# EAGLE design MotorController V3 (EAGLE 9.2.0)
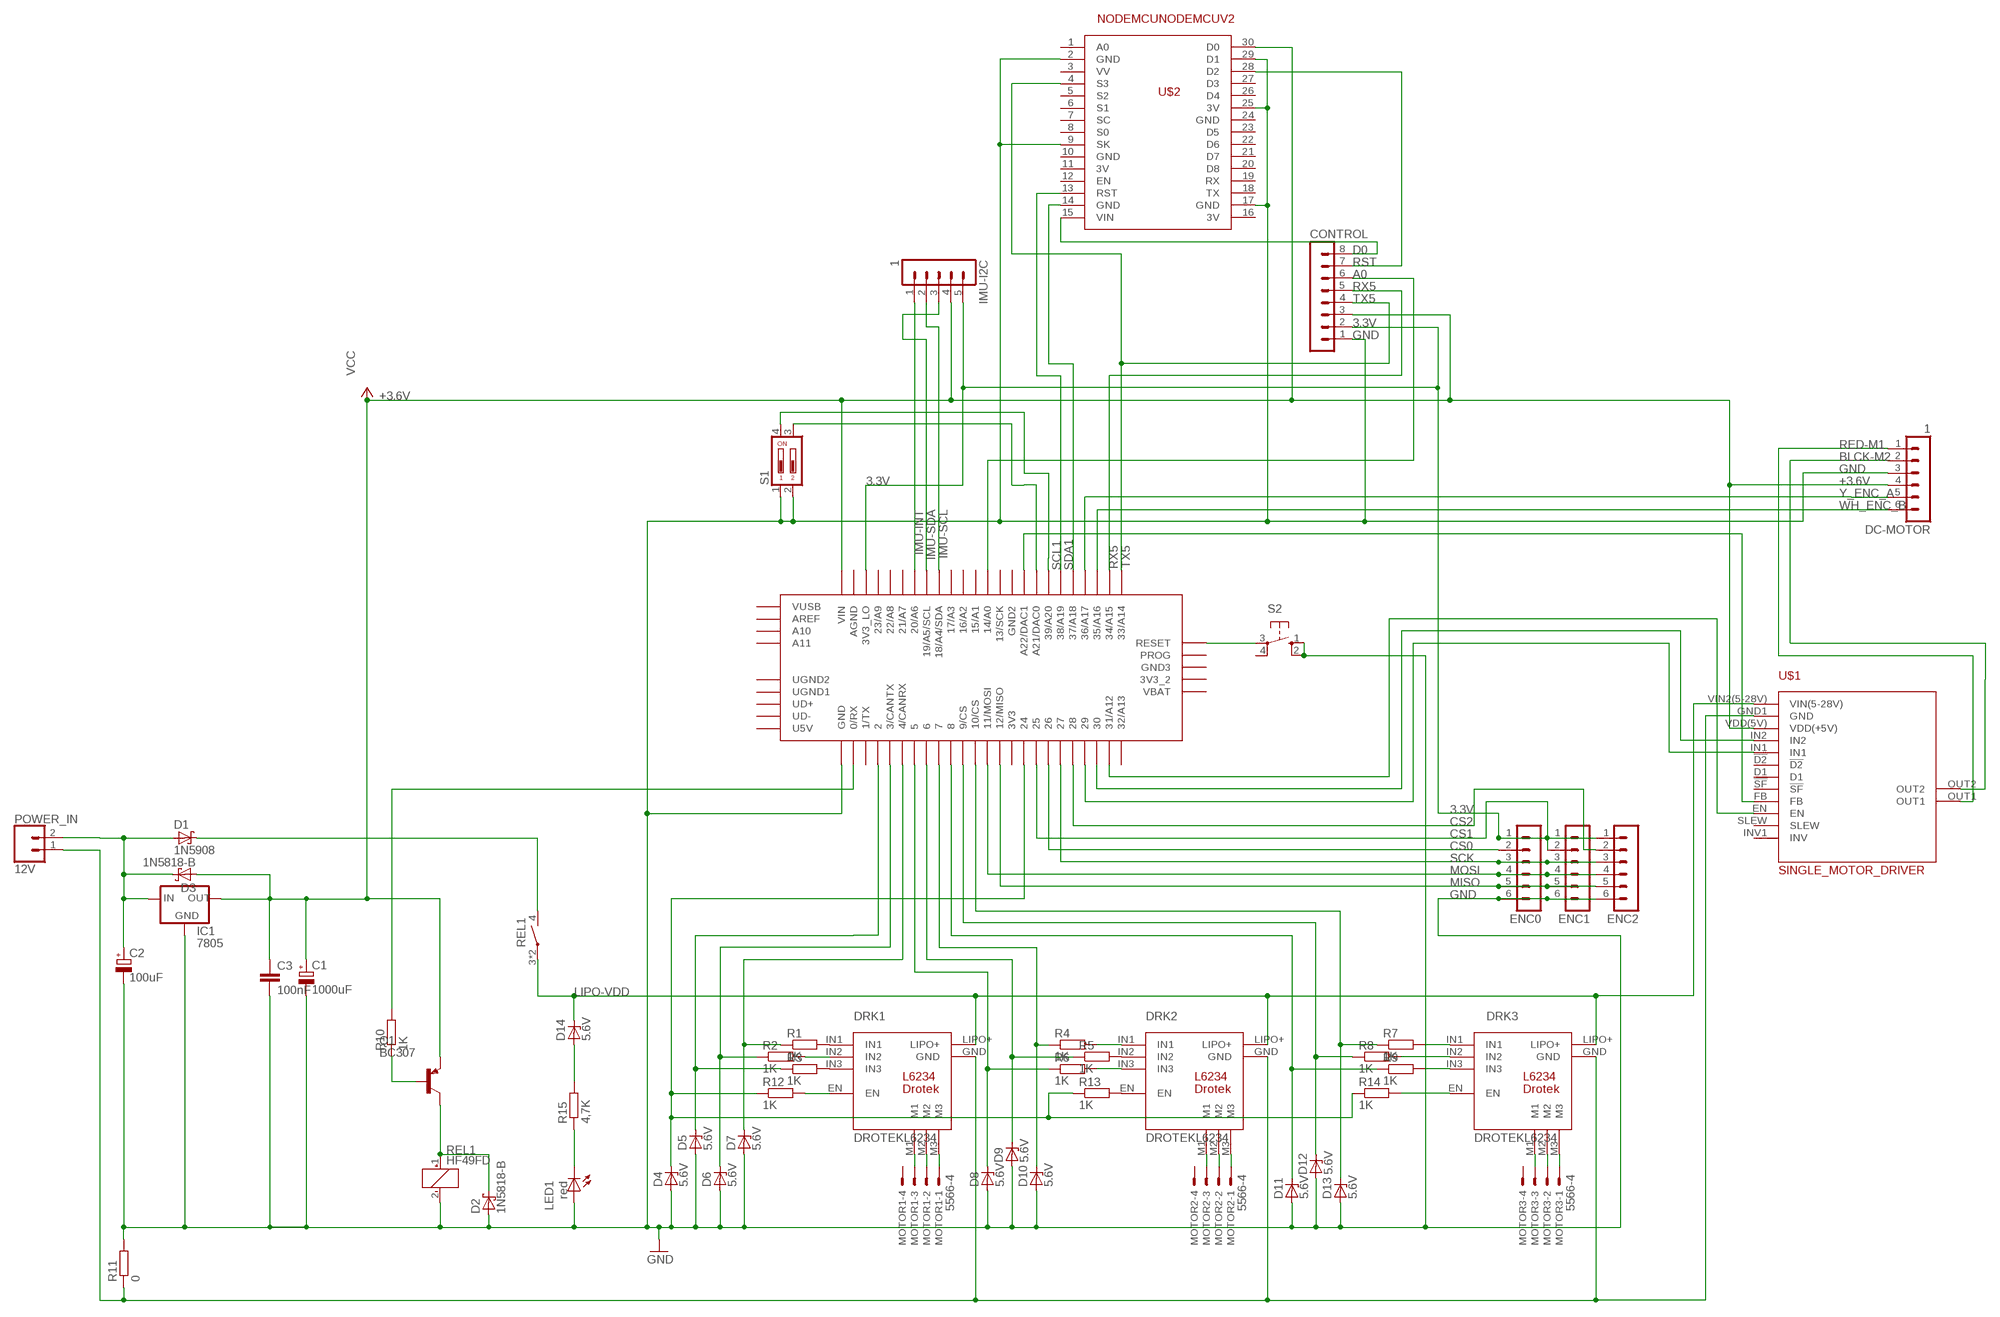
[diagram p0: schematic, sheet 1]

## Parts
C1  1000uF  CPOL-EUE2.5-6  [E2,5-6]
C2  100uF  CPOL-EUE5-5  [E5-5]
C3  100nF  C2.5/2  [C2.5-2]
CONTROL  MA08-1  [MA08-1]
D1  1N5908  [C4111-15]
D2  1N5818-B  [DO41-7.6]
D3  1N5818-B  [DO41-7.6]
D4  5.6V  ZENER-DIODEDO41Z10  [DO41Z10]
D5  5.6V  ZENER-DIODEDO41Z10  [DO41Z10]
D6  5.6V  ZENER-DIODEDO41Z10  [DO41Z10]
D7  5.6V  ZENER-DIODEDO41Z10  [DO41Z10]
D8  5.6V  ZENER-DIODEDO41Z10  [DO41Z10]
D9  5.6V  ZENER-DIODEDO41Z10  [DO41Z10]
D10  5.6V  ZENER-DIODEDO41Z10  [DO41Z10]
D11  5.6V  ZENER-DIODEDO41Z10  [DO41Z10]
D12  5.6V  ZENER-DIODEDO41Z10  [DO41Z10]
D13  5.6V  ZENER-DIODEDO41Z10  [DO41Z10]
D14  5.6V  ZENER-DIODEDO41Z10  [DO41Z10]
DC-MOTOR  1  MA06-1  [MA06-1]
DRK1  DROTEKL6234  [DROTEKL6234]
DRK2  DROTEKL6234  [DROTEKL6234]
DRK3  DROTEKL6234  [DROTEKL6234]
ENC0  MA06-1  [MA06-1]
ENC1  MA06-1  [MA06-1]
ENC2  MA06-1  [MA06-1]
IC1  7805  78XXS  [78XXS]
IMU-I2C  1  MA05-1  [MA05-1]
LED1  red  LED3MM  [LED3MM]
MOTOR1  5566-4  [5566-4]
MOTOR2  5566-4  [5566-4]
MOTOR3  5566-4  [5566-4]
POWER_IN  12V  CONN_023.5MM  [SCREWTERMINAL-3.5MM-2]
PRJ1  TEENSY_3.5/3.6  [TEENSY_3.5/3.6]
Q1  BC307  [TO92]
R1  1K  R-EU_0207/10  [0207/10]
R2  1K  R-EU_0207/10  [0207/10]
R3  1K  R-EU_0207/10  [0207/10]
R4  1K  R-EU_0207/10  [0207/10]
R5  1K  R-EU_0207/10  [0207/10]
R6  1K  R-EU_0207/10  [0207/10]
R7  1K  R-EU_0207/10  [0207/10]
R8  1K  R-EU_0207/10  [0207/10]
R9  1K  R-EU_0207/10  [0207/10]
R10  1K  R-EU_0207/10  [0207/10]
R11  0  R-EU_0204/2V  [0204V]
R12  1K  R-EU_0207/10  [0207/10]
R13  1K  R-EU_0207/10  [0207/10]
R14  1K  R-EU_0207/10  [0207/10]
R15  4,7K  R-EU_0207/10  [0207/10]
REL1  HF49FD  [HF49FD]
S1  DIP02YL  [DIP02YL]
S2  10-XX  [B3F-10XX]
U$1  SINGLE_MOTOR_DRIVER  [MOTOR_DRIVER_MC33926_FOOTPRINT_]
U$2  NODEMCUNODEMCUV2  [NODEMCUV2]

## Nets
3.3V: CONTROL.2 ENC0.1 ENC1.1 ENC2.1 IMU-I2C.5 PRJ1.3V3_LO
+3.6V: C1.+ C3.1 CONTROL.3 D3.A DC-MOTOR.4 IC1.OUT IMU-I2C.4 PRJ1.VIN Q1.1(E) U$1.VDD(5V)(VDD(+5V)) U$2.30(D0) ; supply symbol labelled VCC
A0: CONTROL.6 PRJ1.14/A0
BLCK-M2 [Powerline]: DC-MOTOR.2 U$1.OUT2
CS0: ENC0.2 PRJ1.26
CS1: ENC1.2 PRJ1.25
CS2: ENC2.2 PRJ1.28
D0: CONTROL.8 U$2.15(VIN)
GND: C1.- C2.- C3.2 CONTROL.1 D2.A D4.A D5.A D6.A D7.A D8.A D9.A D10.A D11.A D12.A D13.A DC-MOTOR.3 ENC0.6 ENC1.6 ENC2.6 IC1.GND LED1.A PRJ1.GND R11.2 REL1.2(-) S1.1 S1.2 S2.1(S) S2.2(S1) U$2.2(GND) U$2.9(SK) U$2.17(GND) U$2.25(3V) U$2.29(D1)
IMU-INT: IMU-I2C.1 PRJ1.20/A6
IMU-SCL: IMU-I2C.2 PRJ1.18/A4/SDA
IMU-SDA: IMU-I2C.3 PRJ1.19/A5/SCL
LIPO-GND [Powerline]: DRK1.GND DRK2.GND DRK3.GND POWER_IN.1 R11.1 U$1.GND1(GND)
LIPO-VDD [Powerline]: D14.C DRK1.LIPO+ DRK2.LIPO+ DRK3.LIPO+ REL1.3(P) REL1.5(P) U$1.VIN2(5-28V)(VIN(5-28V))
MISO: ENC0.5 ENC1.5 ENC2.5 PRJ1.12/MISO
MOSI: ENC0.4 ENC1.4 ENC2.4 PRJ1.11/MOSI
N$1 [Powerline]: DRK1.M1 MOTOR1.3
N$2 [Powerline]: DRK1.M2 MOTOR1.2
N$3 [Powerline]: DRK1.M3 MOTOR1.1
N$4: DRK1.IN1 R1.2
N$5: DRK1.IN2 R2.2
N$6: DRK1.IN3 R3.2
N$7: D7.C PRJ1.4/CANRX R1.1
N$8: D6.C PRJ1.3/CANTX R2.1
N$9: D5.C PRJ1.2 R3.1
N$10: DRK3.EN R14.2
N$11: DRK2.IN1 R4.2
N$12: PRJ1.21/DAC0(A21/DAC0) S1.3
N$13 [Powerline]: DRK2.M1 MOTOR2.3
N$14 [Powerline]: DRK2.M2 MOTOR2.2
N$15 [Powerline]: DRK2.M3 MOTOR2.1
N$16 [Powerline]: DRK3.M1 MOTOR3.3
N$17 [Powerline]: DRK3.M2 MOTOR3.2
N$18 [Powerline]: DRK3.M3 MOTOR3.1
N$19: DRK2.IN2 R5.2
N$20: DRK2.IN3 R6.2
N$21: D8.C PRJ1.5 R6.1
N$22: D9.C PRJ1.6 R5.1
N$23: D10.C PRJ1.7 R4.1
N$24: DRK3.IN2 R8.2
N$25: DRK3.IN1 R7.2
N$26: DRK3.IN3 R9.2
N$27: D11.C PRJ1.8 R9.1
N$28: D12.C PRJ1.9/CS R8.1
N$29: D13.C PRJ1.10/CS R7.1
N$30: Q1.2(B) R10.1
N$31: D2.C Q1.3(C) REL1.1(+)
N$32 [Powerline]: C2.+ D1.A D3.C IC1.IN POWER_IN.2
N$33: D14.A R15.2
N$34: LED1.K(C) R15.1
N$39 [Powerline]: D1.C REL1.4(S)
N$40: PRJ1.39/A20 S1.4
N$42: PRJ1.0/RX R10.2
N$43: DRK1.EN R12.2
N$44: PRJ1.29 U$1.IN1
N$45: PRJ1.31/A12 U$1.EN
N$46: D4.C PRJ1.24 R12.1 R13.1 R14.1
N$47: PRJ1.30 U$1.IN2
N$48: DRK2.EN R13.2
N$52: PRJ1.RESET S2.3(P)
N$60: PRJ1.A22/DAC1 U$1.FB
RED-M1 [Powerline]: DC-MOTOR.1 U$1.OUT1
RST: CONTROL.7 U$2.28(D2)
RX5: CONTROL.5 PRJ1.34/A15
SCK: ENC0.3 ENC1.3 ENC2.3 PRJ1.27
SCL1: PRJ1.38/A19 U$2.13(RST)
SDA1: PRJ1.37/A18 U$2.14(GND)
TX5: CONTROL.4 PRJ1.33/A14 U$2.4(S3)
WH_ENC_B: DC-MOTOR.6 PRJ1.35/A16
Y_ENC_A: DC-MOTOR.5 PRJ1.36/A17
Unconnected: MOTOR1.4 MOTOR2.4 MOTOR3.4 PRJ1.1/TX PRJ1.3V3 PRJ1.3V3_2 PRJ1.13/SCK PRJ1.15/A1 PRJ1.16/A2 PRJ1.17/A3 PRJ1.21/A7 PRJ1.22/A8 PRJ1.23/A9 PRJ1.32/A13 PRJ1.A10 PRJ1.A11 PRJ1.AGND PRJ1.AREF PRJ1.GND2 PRJ1.GND3 PRJ1.PROG PRJ1.U5V PRJ1.UD+ PRJ1.UD- PRJ1.UGND1 PRJ1.UGND2 PRJ1.VBAT PRJ1.VUSB S2.4(P1) U$1.!D2 U$1.!SF U$1.D1 U$1.INV1(INV) U$1.SLEW U$2.1(A0) U$2.3(VV) U$2.5(S2) U$2.6(S1) U$2.7(SC) U$2.8(S0) U$2.12(EN) U$2.18(TX) U$2.19(RX) U$2.20(D8) U$2.21(D7) U$2.22(D6) U$2.23(D5) U$2.26(D4) U$2.27(D3)

## Power pins joined to a net without a drawn wire
3V: U$2.11(3V) U$2.16(3V)
GND: U$2.10(GND) U$2.24(GND)

## Library data of the parts
C1 C2 = rcl:CPOL-EU: POLARIZED CAPACITOR, European symbol; SPICEPREFIX: C
C3 = capacitor-wima:C: CAPACITOR naming: grid - package width
CONTROL = con-lstb:MA08-1: PIN HEADER; OC_FARNELL: unknown; OC_NEWARK: unknown
D1 = diode:1N5908: DIODE schottky
D2 D3 = diode:1N581*: 1.0A SCHOTTKY BARRIER RECTIFIER Source: http://www.diodes.com/datasheets/ds23001.pdf
D4-D14 = diode:ZENER-DIODE: Z-Diode
DC-MOTOR ENC0 ENC1 ENC2 = con-lstb:MA06-1: PIN HEADER; OC_FARNELL: unknown; OC_NEWARK: unknown
DRK1-DRK3 = Drotek L6234:DROTEKL6234
IC1 = v-reg:78XXS: VOLTAGE REGULATOR
IMU-I2C = con-lstb:MA05-1: PIN HEADER; OC_FARNELL: unknown; OC_NEWARK: unknown
LED1 = led:LED: LED OSRAM: - CHIPLED LG R971, LG N971, LY N971, LG Q971, LY Q971, LO R971, LY R971 LH N974, LH R974 LS Q976, LO Q976, LY Q976 LO Q996 - Hyper CHIPLED LW Q18S LB Q993, LB Q99A, LB R99A - SideLED LS A670, LO A670, LY A670, LG A670, LP A670 LB A673, LV A673, LT A673, LW A673 LH A674 LY A675 LS A676, LA A676, LO A676, LY A676, LW A676 LS A679, LY A679, LG A679 - Hyper Micro SIDELED® LS Y876, LA Y876, LO Y876, LY Y876 LT Y87S - SmartLED LW L88C, LW L88S LB L89C, LB L89S, LG L890 LS L89K, LO L89K, LY L89K LS L896, LA L896, LO L896, LY L896 - TOPLED LS T670, LO T670, LY T670, LG T670, LP T670 LSG T670, LSP T670, LSY T670, LOP T670, LYG T670 LG T671, LOG T671, LSG T671 LB T673, LV T673, LT T673, LW T673 LH T674 LS T676, LA T676, LO T676, LY T676, LB T676, LH T676, LSB T676, LW T676 LB T67C, LV T67C, LT T67C, LS T67K, LO T67K, LY T67K, LW E67C LS E67B, LA E67B, LO E67B, LY E67B, LB E67C, LV E67C, LT E67C LW T67C LS T679, LY T679, LG T679 LS T770, LO T770, LY T770, LG T770, LP T770 LB T773, LV T773, LT T773, LW T773 LH T774 LS E675, LA E675, LY E675, LS T675 LS T776, LA T776, LO T776, LY T776, LB T776 LHGB T686 LT T68C, LB T68C - Hyper Mini TOPLED® LB M676 - Mini TOPLED Santana® LG M470 LS M47K, LO M47K, LY M47K Source: http://www.osram.convergy.de LUXEON: - LUMILED® LXK2-PW12-R00, LXK2-PW12-S00, LXK2-PW14-U00, LXK2-PW14-V00 LXK2-PM12-R00, LXK2-PM12-S00, LXK2-PM14-U00 LXK2-PE12-Q00, LXK2-PE12-R00, LXK2-PE12-S00, LXK2-PE14-T00, LXK2-PE14-U00 LXK2-PB12-K00, LXK2-PB12-L00, LXK2-PB12-M00, LXK2-PB14-N00, LXK2-PB14-P00, LXK2-PB14-Q00 LXK2-PR12-L00, LXK2-PR12-M00, LXK2-PR14-Q00, LXK2-PR14-R00 LXK2-PD12-Q00, LXK2-PD12-R00, LXK2-PD12-S00 LXK2-PH12-R00, LXK2-PH12-S00 LXK2-PL12-P00, LXK2-PL12-Q00, LXK2-PL12-R00 Source: www.luxeon.com KINGBRIGHT: KA-3528ASYC Source: www.kingbright.com
MOTOR1-MOTOR3 = con-molex:5566-4: Mini FIT connector 4 pol Source: http://www.molex.com; MF: MOLEX; OC_FARNELL: unknown; OC_NEWARK: unknown
POWER_IN = SparkFun-Connectors:CONN_02: Multi connection point. Often used as Generic Header-pin footprint for 0.1 inch spaced/style header connections On any of the 0.1 inch spaced packages, you can populate with these: Break Away Headers - Straight <https://www.sparkfun.com/products/116> (PRT-00116) Break Away Male Headers - Right Angle <https://www.sparkfun.com/products/553> (PRT-00553) Female Headers <https://www.sparkfun.com/products/115> (PRT-00115) Break Away Headers - Machine Pin <https://www.sparkfun.com/products/117> (PRT-00117) Break Away Female Headers - Swiss Machine Pin <https://www.sparkfun.com/products/743> (PRT-00743) For SCREWTERMINALS and SPRING TERMINALS visit here: Screw Terimnals on SparkFun.com <https://www.sparkfun.com/search/results?term=Screw+Terminals> (5mm/3.5mm/2.54mm spacing) This device is also useful as a general connection point to wire up your design to another part of your project. Our various solder wires solder well into these plated through hole pads. Hook-Up Wire - Assortment (Stranded, 22 AWG) <https://www.sparkfun.com/products/11375> (PRT-11375) Hook-Up Wire - Assortment (Solid Core, 22 AWG) <https://www.sparkfun.com/products/11367> (PRT-11367) View the entire wire category on our website here <https://www.sparkfun.com/categories/141> Special notes: Molex polarized connector foot print use with: PRT-08233 with associated crimp pins and housings. 2.54_SCREWTERM for use with PRT-10571. 3.5mm Screw Terminal footprints for PRT-08084 5mm Screw Terminal footprints for use with PRT-08432; PROD_ID: CONN-08399
PRJ1 = Teensy356:TEENSY_3.5/3.6
Q1 = transistor-pnp:BC307: PNP Transistor
R1-R10 R12-R15 = rcl:R-EU_: RESISTOR, European symbol; SPICEPREFIX: R
R11 = resistor:R-EU_: RESISTOR, European symbol
REL1 = relay:HF49FD
S1 = switch-dil:DIP02YL: DIL/CODE SWITCH; OC_FARNELL: unknown; OC_NEWARK: unknown
S2 = switch-omron:10-XX: OMRON SWITCH; MPN: B3F-1000; OC_FARNELL: 176432; OC_NEWARK: 36M3542
U$1 = pololu motor driver:SINGLE_MOTOR_DRIVER: Single Motor Driver (MC33926)
U$2 = nodemcu:NODEMCU

## Net classes
0 default: width 0.254 mm, drill 0.635 mm, clearance 0.508 mm
1 Powerline: width 1 mm, drill 0.635 mm, clearance 0.508 mm

## Board
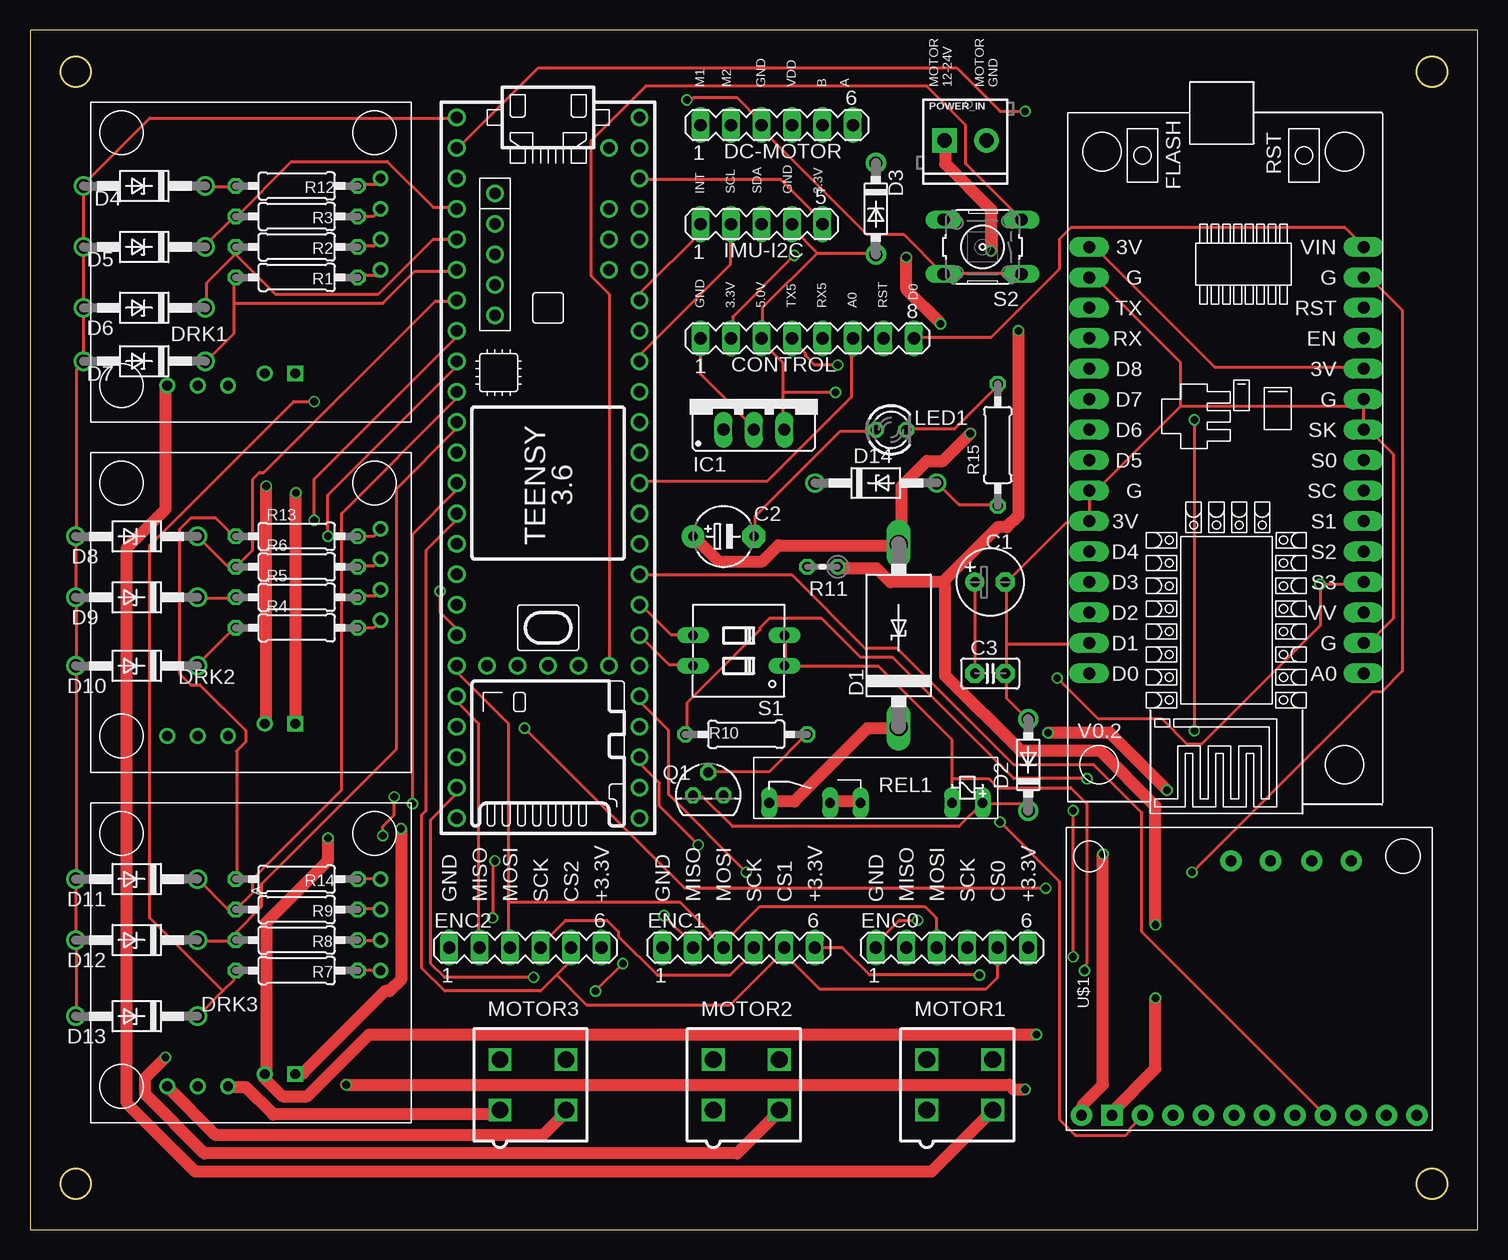
[diagram p1: board, top side]
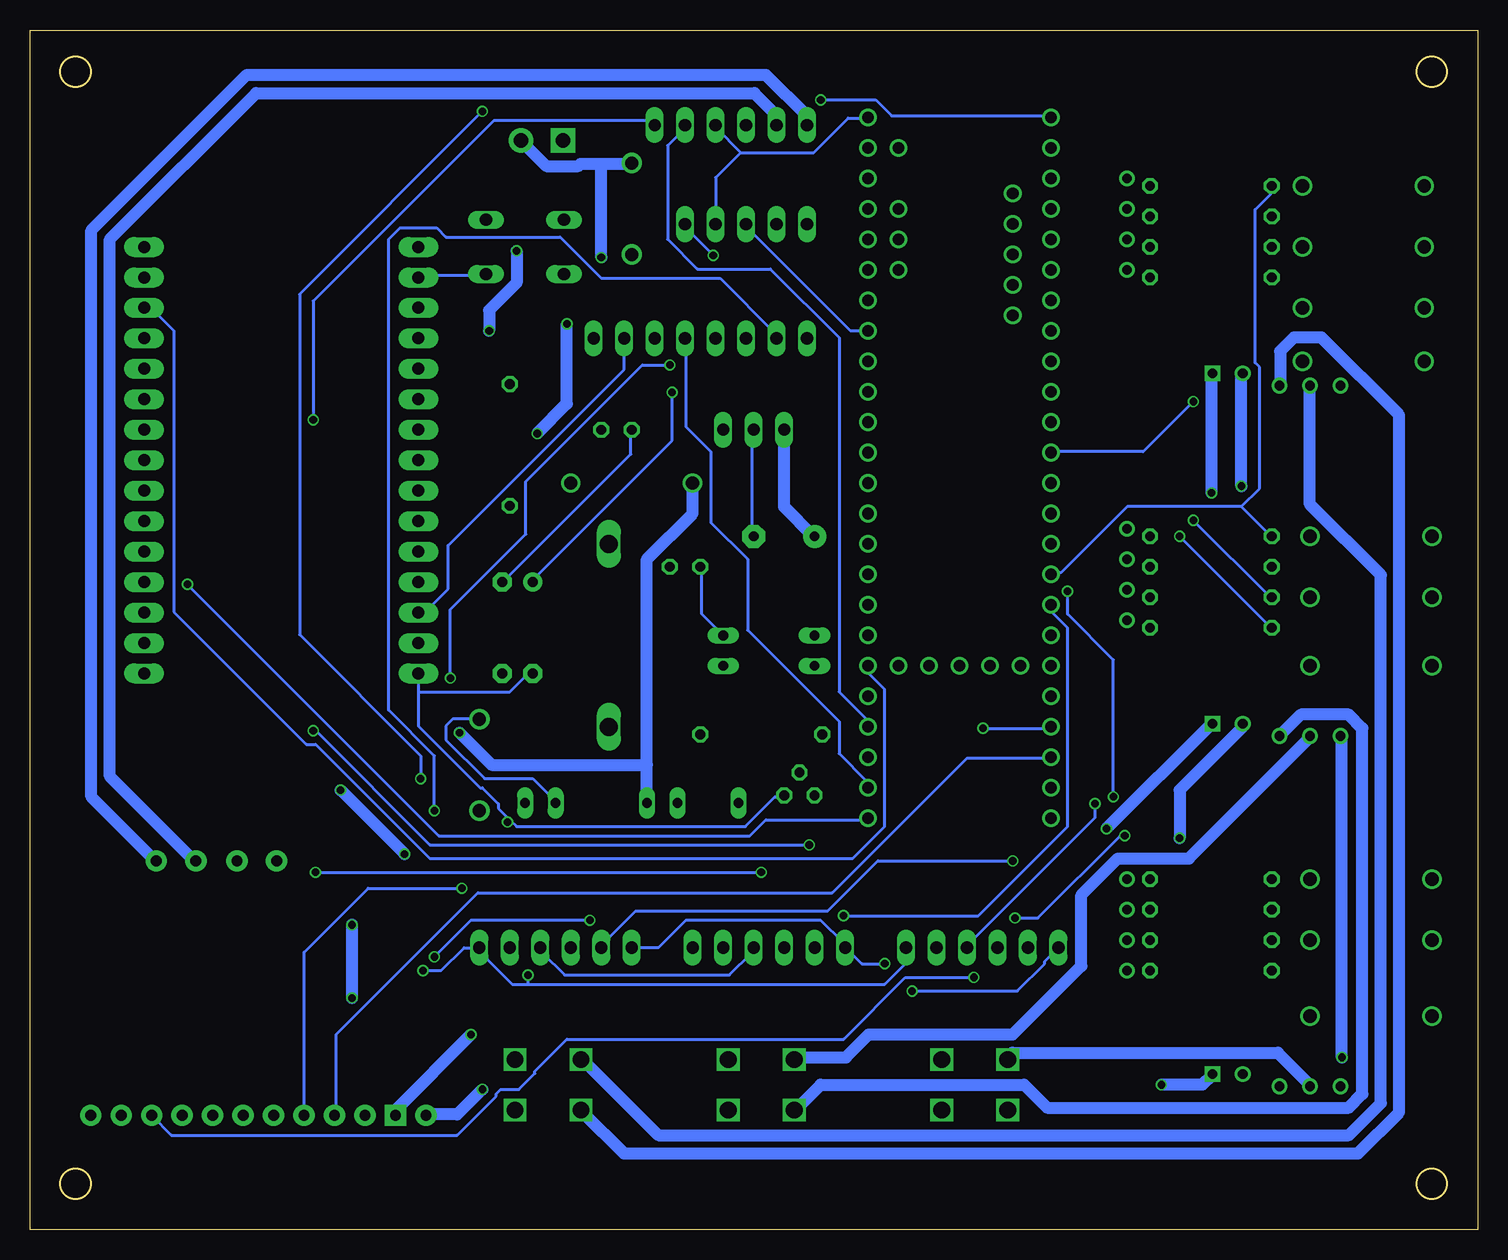
[diagram p2: board, bottom side, seen from below]

Size 120.63 x 100 mm. Coordinates in mm from the lower left corner, seen from the top.
Outline: 0,0 120.63,0 120.63,100 0,100 0,0
Outline: circle at 116.84,96.52 radius 1.27
Outline: circle at 3.81,96.52 radius 1.27
Outline: circle at 3.81,3.81 radius 1.27
Outline: circle at 116.84,3.81 radius 1.27
Copper layers (1*16): Top 0.035mm / dielectric 1.5mm / Bottom 0.035mm
Design rules "aisler_2_layer": minimum track width 0.1mm, minimum drill 0.2mm, track to track 0.1mm, track to pad 0.1mm, pad to pad 0.1mm, via to via 0.1mm, smd to smd 0.1mm, copper to edge 0.2mm, drill to drill 0.21mm, minimum pad ring 0.25mm, minimum via ring 0.15mm, stop-mask expansion 0mil, vias tented up to drill 0mil, thermal gap 10mil

### Footprints (pad centres in the part's own frame; a part is rotated, then mirrored left to right if it is on the bottom)
E2,5-6 = drill 0.813 pad 1.6: + -1.27,0 | drill 0.813 pad 1.6 octagon: - 1.27,0
E5-5 = drill 0.813 pad 1.905: + -2.54,0 | drill 0.813 pad 1.905 octagon: - 2.54,0
C2.5-2 = drill 0.813 pad 1.6 octagon: 1 -1.27,0; 2 1.27,0
MA08-1 = drill 1.016 long: 1 -8.89,0; 2 -6.35,0; 3 -3.81,0; 4 -1.27,0; 5 1.27,0; 6 3.81,0; 7 6.35,0; 8 8.89,0
C4111-15 = drill 1.499 long: A 7.62,0; C -7.62,0
DO41-7.6 = drill 1.1 pad 1.7: A 3.81,0; C -3.81,0
DO41Z10 = drill 1.118: A 5.08,0; C -5.08,0
MA06-1 = drill 1.016 long: 1 -6.35,0; 2 -3.81,0; 3 -1.27,0; 4 1.27,0; 5 3.81,0; 6 6.35,0
DROTEKL6234 = drill 0.813 pad 1.27: EN -11.43,-6.35; GND -1.778,9.906; IN1 -11.43,1.27; IN2 -11.43,-1.27; IN3 -11.43,-3.81; M1 6.35,10.922; M2 3.81,10.922; M3 1.27,10.922 | drill 0.813 square: LIPO+ -4.318,9.906
78XXS = drill 1.016 long: GND 0,-2.54; IN -2.54,-2.54; OUT 2.54,-2.54
MA05-1 = drill 1.016 long: 1 -5.08,0; 2 -2.54,0; 3 0,0; 4 2.54,0; 5 5.08,0
LED3MM = drill 0.813 octagon: A -1.27,0; K 1.27,0
5566-4 = drill 1.4 square: 1 2.1,-2.75; 2 -2.1,-2.75; 3 2.1,2.75; 4 -2.1,2.75
SCREWTERMINAL-3.5MM-2 = drill 1.2 pad 2.032 square: 1 0,0 | drill 1.2 pad 2.032: 2 3.5,0
TEENSY_3.5/3.6 = drill 0.965: 0/RX -25.4,-7.62; 1/TX -22.86,-7.62; 2 -20.32,-7.62; 3/CANTX -17.78,-7.62; 3V3 7.62,-7.62; 3V3_2 17.78,-2.54; 3V3_LO -22.86,7.62; 4/CANRX -15.24,-7.62; 5 -12.7,-7.62; 6 -10.16,-7.62; 7 -7.62,-7.62; 8 -5.08,-7.62; 9/CS -2.54,-7.62; 10/CS 0,-7.62; 11/MOSI 2.54,-7.62; 12/MISO 5.08,-7.62; 13/SCK 5.08,7.62; 14/A0 2.54,7.62; 15/A1 0,7.62; 16/A2 -2.54,7.62; 17/A3 -5.08,7.62; 18/A4/SDA -7.62,7.62; 19/A5/SCL -10.16,7.62; 20/A6 -12.7,7.62; 21/A7 -15.24,7.62; 21/DAC0 12.7,7.62; 22/A8 -17.78,7.62; 23/A9 -20.32,7.62; 24 10.16,-7.62; 25 12.7,-7.62; 26 15.24,-7.62; 27 17.78,-7.62; 28 20.32,-7.62; 29 22.86,-7.62; 30 25.4,-7.62; 31/A12 27.94,-7.62; 32/A13 30.48,-7.62; 33/A14 30.48,7.62; 34/A15 27.94,7.62; 35/A16 25.4,7.62; 36/A17 22.86,7.62; 37/A18 20.32,7.62; 38/A19 17.78,7.62; 39/A20 15.24,7.62; A10 -17.78,5.08; A11 -15.24,5.08; A22/DAC1 10.16,7.62; AGND -25.4,7.62; AREF -20.32,5.08; GND -27.94,-7.62; GND2 7.62,7.62; GND3 17.78,0; PROG 17.78,2.54; RESET 17.78,5.08; U5V -21.59,-4.445; UD+ -16.51,-4.445; UD- -19.05,-4.445; UGND1 -13.97,-4.445; UGND2 -11.43,-4.445; VBAT 17.78,-5.08; VIN -27.94,7.62; VUSB -25.4,5.08
TO92 = drill 0.813 octagon: 1 1.27,0; 2 0,1.905; 3 -1.27,0
0207/10 = drill 0.813 octagon: 1 -5.08,0; 2 5.08,0
0204V = drill 0.813 octagon: 1 -1.27,0; 2 1.27,0
HF49FD = drill 0.813 long: 1 -7.62,0; 2 -5.08,0; 3 2.54,0; 4 10.16,0; 5 5.08,0
DIP02YL = drill 0.813 long: 1 -1.27,-3.81; 2 1.27,-3.81; 3 1.27,3.81; 4 -1.27,3.81
B3F-10XX = drill 1.016 long: 1 -3.251,2.261; 2 3.251,2.261; 3 -3.251,-2.261; 4 3.251,-2.261
MOTOR_DRIVER_MC33926_FOOTPRINT_ = drill 0.9 pad 1.778: !D2 -3.81,0; !SF -3.81,-5.08; D1 -3.81,-2.54; EN -3.81,-10.16; FB -3.81,-7.62; GND 17.399,-3.048; IN1 -3.81,2.54; IN2 -3.81,5.08; INV1 -3.81,-15.24; OUT1 17.399,-9.779; OUT2 17.399,-6.477; SLEW -3.81,-12.7; VDD(5V) -3.81,7.62; VIN2(5-28V) -3.81,12.7; VIN(5-28V) 17.399,0.254 | drill 0.9 pad 1.778 square: GND1 -3.81,10.16
NODEMCUV2 = drill 1 pad 1.676 long: 1 -13.97,17.78; 2 -13.97,15.24; 3 -13.97,12.7; 4 -13.97,10.16; 5 -13.97,7.62; 6 -13.97,5.08; 7 -13.97,2.54; 8 -13.97,0; 9 -13.97,-2.54; 10 -13.97,-5.08; 11 -13.97,-7.62; 12 -13.97,-10.16; 13 -13.97,-12.7; 14 -13.97,-15.24; 15 -13.97,-17.78; 16 8.89,-17.78; 17 8.89,-15.24; 18 8.89,-12.7; 19 8.89,-10.16; 20 8.89,-7.62; 21 8.89,-5.08; 22 8.89,-2.54; 23 8.89,0; 24 8.89,2.54; 25 8.89,5.08; 26 8.89,7.62; 27 8.89,10.16; 28 8.89,12.7; 29 8.89,15.24; 30 8.89,17.78

### Placement (x,y rotation side)
C1  80.01,53.98 0 top
C2  57.79,57.78 0 top
C3  80.01,46.35 0 top
CONTROL  64.77,74.3 0 top
D1  72.39,49.53 90 top
D2  83.19,38.73 90 top
D3  70.49,85.09 270 top
D4  9.53,87 180 top
D5  9.53,81.91 180 top
D6  9.53,76.84 180 top
D7  9.53,72.39 180 top
D8  8.89,57.78 180 top
D9  8.89,52.7 180 top
D10  8.89,46.99 180 top
D11  8.89,29.21 180 top
D12  8.89,24.13 180 top
D13  8.89,17.78 180 top
D14  70.49,62.23 0 top
DC-MOTOR  62.23,92.08 0 top
DRK1  17.78,81.28 180 top
DRK2  17.78,52.07 180 top
DRK3  17.78,22.86 180 top
ENC0  76.84,23.5 0 top
ENC1  59.06,23.5 0 top
ENC2  41.28,23.5 0 top
IC1  60.33,69.22 0 top
IMU-I2C  60.96,83.82 0 top
LED1  71.76,66.67 0 top
MOTOR1  77.47,12.07 270 top
MOTOR2  59.69,12.07 270 top
MOTOR3  41.91,12.07 270 top
POWER_IN  76.2,90.8 0 top
PRJ1  43.18,64.77 270 top
Q1  56.52,36.2 0 top
R1  22.23,79.38 0 top
R2  22.23,81.91 0 top
R3  22.23,84.45 0 top
R4  22.23,50.16 0 top
R5  22.23,52.7 0 top
R6  22.23,55.24 0 top
R7  22.23,21.59 0 top
R8  22.23,24.13 0 top
R9  22.23,26.67 0 top
R10  59.69,41.27 180 top
R11  66.04,55.24 180 top
R12  22.23,87 0 top
R13  22.23,57.78 0 top
R14  22.23,29.21 0 top
R15  80.65,65.41 270 top
REL1  71.76,35.56 180 top
S1  59.06,48.26 90 top
S2  79.38,81.91 180 top
U$1  100.33,13.34 90 top
U$2  97.16,64.14 180 top

### Tracks (layer width: path | path; a pad name or v marks a point on that pad's centre or on a via)
3.3V  (via drill 0.64)
  Top 0.254: PRJ1.3V3_LO 50.93,87.5 62.55,87.5 66.17,83.88 IMU-I2C.5 | v63.69,81.22 58.55,76.07 58.55,74.36 CONTROL.2 | v49.4,22.16 v47.12,19.88 | v86.93,22.73 v86.93,34.92 | v73.98,25.78 72.45,25.78 70.55,23.88 70.55,23.5 ENC0.1
  Bottom 0.254: v63.69,81.22 66.17,83.69 IMU-I2C.5 | ENC2.1 36.07,22.35 36.07,22.16 38.35,19.88 v47.12,19.88 | v49.4,22.16 51.31,22.16 52.64,23.5 ENC1.1 52.83,23.5 52.83,23.88 54.74,25.78 65.98,25.78 68.26,23.5 ENC0.1 | v86.93,34.92 86.93,39.5 90.74,43.31 90.74,82.55 89.79,83.5 86.74,83.5 85.98,82.74 76.45,82.74 73.03,79.31 63.12,79.31 58.55,74.74 58.55,74.36 CONTROL.2 | v86.93,22.73 83.88,25.78 v73.98,25.78
3V
  Top 0.254: U$2.11 111.12,71.88 98.74,71.88 88.84,81.79 88.27,81.79 U$2.16
+3.6V  (via drill 0.64)
  Top 0.254: 62.74,69.79 62.74,72.26 60.83,74.17 CONTROL.3 61.02,74.36 61.02,76.84 65.59,81.41 | 62.74,69.79 62.74,66.74 IC1.OUT | 65.59,81.41 70.36,81.41 D3.A | 65.59,81.41 63.5,83.5 IMU-I2C.4 | C1.+ C3.1 | v80.84,33.97 85.79,29.02 85.79,9.21 87.12,7.87 91.31,7.87 91.69,8.26 91.69,8.45 92.65,9.4 U$1.VDD(5V) | v67.12,69.79 62.74,69.79
  Bottom 0.254: 61.41,89.79 55.31,89.79 52.45,92.65 50.93,92.65 PRJ1.VIN | 61.41,89.79 63.5,91.89 DC-MOTOR.4 | IMU-I2C.4 63.5,87.69 61.41,89.79 | 80.65,34.16 81.6,35.12 81.6,35.5 82.93,36.83 83.12,36.83 88.27,41.97 88.27,44.83 | 80.65,34.16 80.07,33.59 61.02,33.59 58.55,36.07 57.79,36.07 Q1.1 | U$2.30 88.27,44.83 | 80.65,34.16 v80.84,33.97 | C3.1 79.12,46.35 80.65,44.83 88.27,44.83 | v67.12,69.79 67.12,65.79 78.74,54.17 C1.+
A0
  Top 0.254: PRJ1.14/A0 50.93,62.36 61.41,62.36 68.45,69.41 68.45,74.17 CONTROL.6
BLCK-M2
  Bottom 1: DC-MOTOR.2 58.55,92.08 58.55,93.03 60.26,94.74 101.79,94.74 113.98,82.55 113.98,37.78 106.93,30.73 U$1.OUT2
CS0  (via drill 0.64)
  Top 0.254: v34.16,53.21 34.16,51.5 35.5,50.16 35.5,49.59 PRJ1.26 | v30.35,36.07 30.35,34.54 29.4,33.59 v29.4,32.83 | v38.54,25.97 38.54,30.54 v38.74,30.73
  Bottom 0.254: v34.16,53.21 34.16,51.31 30.35,47.5 v30.35,36.07 | v29.4,32.83 29.78,32.83 36.64,25.97 v38.54,25.97 | v38.74,30.73 49.97,30.73 54.17,26.54 70.17,26.54 73.03,23.69 ENC0.2
CS1  (via drill 0.64)
  Top 0.254: v52.83,26.16 55.12,23.88 55.12,23.5 ENC1.2
  Bottom 0.254: v52.83,26.16 41.59,26.16 34.16,33.59 34.16,50.16 35.5,51.5 35.5,52.07 PRJ1.25
CS2
  Top 0.254: PRJ1.28 35.69,44.45 35.69,43.88 37.4,42.16 37.4,23.5 ENC2.2
D0
  Top 0.254: CONTROL.8 73.79,74.36 80.07,74.36 85.79,80.07 85.79,82.55 86.74,83.5 109.6,83.5 111.12,81.98 U$2.15
GND  (via drill 0.64)
  Top 0.254: D13.A 3.87,17.78 3.87,24.07 D12.A 3.87,24.26 3.87,29.21 | 3.87,57.78 3.87,52.83 D9.A 3.87,52.64 3.87,47.12 D10.A 3.87,46.93 3.87,29.21 | PRJ1.GND 35.5,92.65 9.97,92.65 4.45,87.12 D4.A D5.A D6.A D7.A 4.45,72.26 3.87,71.69 3.87,57.78 | 3.87,57.78 D8.A | 3.87,29.21 D11.A | S2.1 82.55,79.69 76.26,79.69 S2.2 76.07,79.69 72.84,82.93 69.79,82.93 61.02,91.69 61.02,92.08 DC-MOTOR.3 60.83,92.08 60.83,92.46 58.93,94.36 55.31,94.36 55.12,94.17 v54.74,94.17 | ENC1.6 67.69,23.5 69.98,21.21 v79.12,21.21 | LED1.A 70.36,66.55 67.5,66.55 60.45,59.5 60.45,57.78 C2.- | CONTROL.1 55.88,71.31 60.45,66.74 IC1.GND | U$2.2 111.12,49.02 111.7,49.02 113.6,50.93 113.6,64.64 111.7,66.55 111.12,66.55 U$2.9 111.12,68.64 | S1.2 62.93,49.4 62.93,47.12 S1.1 62.93,46.93 70.74,46.93 76.84,40.83 76.84,37.59 | 81.41,46.35 81.41,44.26 83.12,42.55 D2.A | 81.41,46.35 81.41,48.83 | 81.41,48.83 81.41,53.98 | 81.41,46.35 C3.2 | 81.41,48.83 88.27,48.83 U$2.29 | 81.41,53.98 86.36,58.93 88.27,58.93 U$2.25 U$2.24 88.84,61.59 95.89,68.64 | 81.41,53.98 C1.- | REL1.2 76.84,37.59 | 95.89,68.64 111.12,68.64 | 111.12,68.64 U$2.10 | v87.88,21.59 87.88,21.97 88.08,22.16 88.08,35.5 86.74,36.83 80.65,36.83 79.88,37.59 76.84,37.59 | 95.89,68.64 95.89,72.26 88.84,79.31 88.27,79.31 U$2.17
  Bottom 0.254: U$2.17 88.27,79.5 82.74,79.5 S2.1 | 79.12,20.45 80.45,20.45 83.12,23.11 83.12,23.5 ENC0.6 84.46,23.5 86.36,21.59 v87.88,21.59 | 79.12,20.45 49.4,20.45 47.69,22.16 47.69,23.5 ENC2.6 | 79.12,20.45 v79.12,21.21 | IC1.GND 60.45,66.55 60.45,57.78 C2.- | S1.2 64.64,51.31 64.64,55.12 R11.2 | D2.A 85.41,42.55 85.98,41.97 85.98,40.83 82.74,37.59 78.74,37.59 76.84,35.69 REL1.2 | LED1.A 70.55,66.55 70.55,64.64 81.22,53.98 C1.- | v54.74,94.17 50.17,94.17 48.83,92.84 35.69,92.84 PRJ1.GND
IMU-INT
  Top 0.254: IMU-I2C.1 55.88,83.12 50.93,78.17 50.93,77.6 PRJ1.20/A6
IMU-SCL
  Top 0.254: PRJ1.18/A4/SDA 50.93,72.45 50.93,73.03 58.36,80.45 58.36,83.69 IMU-I2C.2
IMU-SDA
  Bottom 0.254: PRJ1.19/A5/SCL 52.26,74.93 61.02,83.69 IMU-I2C.3
LIPO-GND  (via drill 0.64)
  Top 1: 76.07,53.98 71.69,53.98 70.55,55.12 67.31,55.12 R11.1 | 76.07,53.98 80.65,58.55 81.41,58.55 82.36,59.5 v82.36,74.93 | v80.07,81.6 80.07,85.03 76.26,88.84 76.26,90.74 POWER_IN.1 | v24.83,32.64 24.83,30.73 19.69,25.59 19.69,13.02 DRK3.GND 19.5,12.64 21.02,11.11 23.11,11.11 28.26,16.26 v83.88,16.26 | v19.69,61.98 19.69,42.16 DRK2.GND | v93.79,25.4 93.79,35.31 89.22,39.88 82.55,39.88 76.26,46.16 76.26,53.59 76.07,53.98 | v93.79,19.3 93.79,13.4 90.17,9.78 U$1.GND1
  Bottom 1: v82.36,74.93 82.36,76.64 80.07,78.93 v80.07,81.6 | v24.83,32.64 24.83,36.64 19.69,41.78 19.69,42.16 DRK2.GND | v19.69,61.98 19.69,71.31 DRK1.GND | U$1.GND1 90.17,9.97 v83.88,16.26 | v93.79,19.3 v93.79,25.4
LIPO-VDD  (via drill 0.64)
  Top 1: REL1.5 66.74,35.69 69.22,35.69 REL1.3 | v30.93,33.4 30.93,20.83 29.97,19.88 29.59,19.88 22.73,13.02 22.16,13.02 DRK3.LIPO+ | v22.16,61.4 22.16,42.16 DRK2.LIPO+ | v82.93,11.68 81.98,11.68 81.6,12.07 v26.35,12.07 | v84.84,41.4 89.98,41.4 v94.74,36.64 | v89.41,31.3 89.41,12.07 87.69,10.35 87.69,9.59 U$1.VIN2(5-28V)
  Bottom 1: D14.C 65.41,59.69 69.22,55.88 69.22,38.73 | REL1.3 69.22,38.73 | v30.93,33.4 22.16,42.16 DRK2.LIPO+ | v22.16,61.4 22.16,71.31 DRK1.LIPO+ | v82.93,11.68 85.03,9.59 87.5,9.59 U$1.VIN2(5-28V) | v26.35,12.07 22.92,12.07 22.16,12.83 DRK3.LIPO+ | 69.22,38.73 82.17,38.73 v84.84,41.4 | v89.41,31.3 v94.74,36.64
MISO
  Top 0.254: 43.88,21.21 45.02,22.35 45.02,23.5 ENC2.5 | 43.88,21.21 42.55,19.88 34.54,19.88 32.64,21.78 32.64,34.54 33.02,34.92 33.02,56.64 35.5,59.12 35.5,59.69 PRJ1.12/MISO | 62.74,23.11 62.74,23.5 ENC1.5 62.74,23.11 | 62.74,23.11 58.36,18.73 46.36,18.73 43.88,21.21 | ENC0.5 80.65,21.02 79.69,20.07 65.79,20.07 62.74,23.11
MOSI  (via drill 0.64)
  Top 0.254: v31.88,35.5 31.88,57.98 35.5,61.59 35.5,62.17 PRJ1.11/MOSI | ENC2.4 42.55,23.69 44.64,25.78 48.07,25.78 49.02,24.83 49.02,24.45 52.26,21.21 58.36,21.21 60.26,23.11 60.26,23.5 ENC1.4
  Bottom 0.254: ENC1.4 60.45,23.5 60.45,23.11 62.36,21.21 76.07,21.21 77.98,23.11 77.98,23.5 ENC0.4 | v31.88,35.5 31.88,34.35 42.55,23.69 ENC2.4
N$1
  Top 1: DRK1.M1 11.3,70.36 11.3,60.07 8.07,56.83 8.07,10.54 13.78,4.83 75.12,4.83 80.07,9.78 MOTOR1.3
N$2
  Bottom 1: DRK1.M2 13.97,60.45 8.07,54.55 8.07,10.54 10.73,7.87 68.26,7.87 74.55,14.16 MOTOR1.2
N$3
  Bottom 1: DRK1.M3 16.45,70.36 16.45,73.22 15.3,74.36 13.02,74.36 6.54,67.88 6.54,9.78 9.97,6.35 71.12,6.35 74.55,9.78 MOTOR1.1
N$4
  Top 0.254: R1.2 27.31,79.5 28.83,79.5 29.21,79.88 DRK1.IN1
N$5
  Top 0.254: DRK1.IN2 28.64,81.98 27.31,81.98 R2.2
N$6
  Top 0.254: R3.2 28.64,84.45 29.21,85.03 DRK1.IN3
N$7
  Top 0.254: 17.02,77.22 17.02,74.74 14.73,72.45 D7.C | 17.02,77.22 17.02,79.31 R1.1 | 17.02,77.22 29.4,77.22 32.07,79.88 35.5,79.88 PRJ1.4/CANRX
N$8
  Top 0.254: 17.02,81.41 17.02,81.22 14.73,78.93 14.73,76.84 D6.C | 17.02,81.41 17.02,81.79 R2.1 17.02,81.41 | PRJ1.3/CANTX 33.59,82.55 29.02,77.98 20.45,77.98 17.02,81.41
N$9
  Top 0.254: D5.C 14.54,81.98 17.02,84.45 R3.1 17.21,84.45 21.78,89.03 29.78,89.03 33.59,85.22 35.5,85.22 PRJ1.2
N$10
  Top 0.254: DRK3.EN R14.2
N$11
  Top 0.254: R4.2 28.64,50.16 29.21,50.74 DRK2.IN1
N$12
  Top 0.254: S1.3 55.12,49.59 53.4,49.59 50.93,52.07 PRJ1.21/DAC0
N$13  (via drill 0.64)
  Top 1: v11.3,14.35 9.59,12.64 9.59,11.3 14.54,6.35 58.93,6.35 62.36,9.78 MOTOR2.3
  Bottom 1: v11.3,14.35 11.3,41.02 DRK2.M1
N$14
  Bottom 1: DRK2.M2 13.97,41.02 24.07,30.92 29.97,30.92 33.02,27.88 33.02,21.97 38.74,16.26 50.74,16.26 52.64,14.35 56.83,14.35 MOTOR2.2
N$15
  Bottom 1: DRK2.M3 14.73,42.93 10.73,42.93 9.59,41.78 9.59,11.3 10.73,10.16 35.88,10.16 37.78,12.07 54.74,12.07 56.83,9.97 MOTOR2.1
N$16
  Top 1: DRK3.M1 15.49,7.87 42.74,7.87 44.64,9.78 MOTOR3.3
N$17
  Bottom 1: DRK3.M2 13.97,12.07 16.64,14.73 38.74,14.73 39.12,14.35 MOTOR3.2
N$18
  Top 1: DRK3.M3 16.64,11.88 17.97,11.88 20.26,9.59 38.93,9.59 39.12,9.78 MOTOR3.1
N$19
  Top 0.254: R5.2 27.31,52.83 28.83,52.83 29.21,53.21 DRK2.IN2
N$20
  Top 0.254: DRK2.IN3 28.64,55.31 27.31,55.31 R6.2
N$21
  Top 0.254: D8.C 16.45,55.31 17.02,55.31 R6.1 18.54,56.64 18.54,62.55 19.11,63.12 19.5,63.12 33.78,77.41 35.5,77.41 PRJ1.5
N$22  (via drill 0.64)
  Top 0.254: R5.1 17.02,52.64 13.97,52.64 D9.C | v23.69,59.12 23.69,62.55 35.5,74.36 35.5,74.93 PRJ1.6
  Bottom 0.254: v23.69,59.12 17.21,52.64 R5.1
N$23  (via drill 0.64)
  Top 0.254: R4.1 17.02,50.16 13.97,47.12 D10.C | v24.83,57.78 24.83,61.21 35.5,71.88 35.5,72.26 PRJ1.7
  Bottom 0.254: v24.83,57.78 17.21,50.16 R4.1
N$24
  Top 0.254: R8.2 27.31,24.07 29.21,24.07 DRK3.IN2
N$25
  Top 0.254: DRK3.IN1 R7.2
N$26
  Top 0.254: R9.2 27.31,26.73 29.21,26.73 DRK3.IN3
N$27
  Top 0.254: D11.C 16.45,26.73 17.02,26.73 R9.1 18.54,28.07 18.54,29.21 25.97,36.64 25.97,59.69 35.5,69.22 35.5,69.79 PRJ1.8
N$28
  Top 0.254: D12.C 13.97,24.07 17.02,24.07 R8.1 17.21,24.26 17.21,24.83 19.3,26.92 19.3,28.83 30.54,40.07 30.54,61.79 35.5,66.74 35.5,67.31 PRJ1.9/CS
N$29  (via drill 0.64)
  Top 0.254: D13.C 16.07,19.88 | 16.07,19.88 17.02,20.83 17.02,21.59 R7.1 | v23.69,69.02 21.97,69.02 9.97,57.02 9.97,25.97 16.07,19.88
  Bottom 0.254: v23.69,69.02 27.88,64.83 35.5,64.83 PRJ1.10/CS
N$30
  Top 0.254: Q1.2 56.64,38.16 61.6,38.16 64.64,41.21 R10.1
N$31
  Top 0.254: D2.C 83.12,34.92 82.55,35.5 79.5,35.5 REL1.1 77.41,33.59 58.55,33.59 56.07,36.07 55.31,36.07 Q1.3
N$32  (via drill 0.64)
  Top 1: C2.+ 55.31,57.78 57.4,55.69 61.02,55.69 62.36,57.02 72.26,57.02 D1.A 72.64,57.59 72.64,61.98 74.74,64.07 76.07,64.07 v78.36,66.36 | v73.03,81.03 73.03,78.36 v75.88,75.5
  Bottom 1: 73.03,88.84 74.74,88.84 74.93,88.65 77.6,88.65 79.69,90.74 POWER_IN.2 | 73.03,88.84 70.55,88.84 D3.C | IC1.IN 57.79,60.26 55.31,57.78 C2.+ | v73.03,81.03 73.03,88.84 | v75.88,75.5 75.88,68.83 v78.36,66.36
N$33
  Top 0.254: R15.2 80.65,60.45 77.41,60.45 75.69,62.17 D14.A
N$34
  Top 0.254: LED1.K 73.03,66.74 77.03,66.74 80.65,70.36 R15.1
N$39
  Top 1: REL1.4 61.6,35.69 63.69,35.69 69.79,41.78 72.26,41.78 D1.C
N$40
  Top 0.254: PRJ1.39/A20 53.21,47.12 55.12,47.12 S1.4
N$42  (via drill 0.64)
  Top 0.254: v88.08,37.59 81.98,37.59 71.88,47.69 69.22,47.69 65.98,50.93 61.6,50.93 60.83,50.16 60.83,49.98 54.74,43.88 54.74,41.4 R10.2 | v82.93,93.22 80.84,93.22 77.22,96.84 42.36,96.84 35.69,90.17 PRJ1.0/RX
  Bottom 0.254: v88.08,37.59 88.08,39.5 98.17,49.59 98.17,77.98 v82.93,93.22
N$43
  Top 0.254: R12.2 27.31,87.12 28.83,87.12 29.21,87.5 DRK1.EN
N$44  (via drill 0.64)
  Top 0.254: v41.21,41.78 54.55,28.45 v84.65,28.45
  Bottom 0.254: v41.21,41.78 35.69,41.78 PRJ1.29 | v84.65,28.45 92.46,28.45 97.79,23.11 U$1.IN1
N$45  (via drill 0.64)
  Top 0.254: v41.97,21.02 34.54,21.02 33.4,22.16 33.4,34.16 35.5,36.26 35.5,36.83 PRJ1.31/A12
  Bottom 0.254: v41.97,21.02 47.69,21.02 52.83,15.88 75.88,15.88 78.55,13.21 78.55,13.02 79.88,11.68 81.41,11.68 81.79,11.3 81.79,11.11 85.03,7.87 108.84,7.87 U$1.EN
N$46
  Top 0.254: R12.1 17.02,86.93 14.73,86.93 D4.C | R14.1 17.21,29.21 17.21,39.88 17.97,40.64 17.97,41.59 14.16,45.4 13.4,45.4 12.45,46.35 12.45,58.36 13.4,59.31 15.49,59.31 17.02,57.78 R13.1
  Bottom 0.254: 19.69,60.26 29.21,60.26 34.73,54.74 35.5,54.74 PRJ1.24 | 19.69,60.26 17.21,57.78 R13.1 | 19.69,60.26 18.16,61.79 18.16,71.88 18.54,72.26 18.54,85.03 17.21,86.36 17.21,86.93 R12.1
N$47
  Bottom 0.254: PRJ1.30 35.69,39.31 42.55,39.31 53.79,28.07 83.31,28.07 95.12,16.26 95.12,9.59 U$1.IN2
N$48
  Top 0.254: R13.2 28.64,57.78 29.21,58.36 DRK2.EN
N$52
  Top 0.254: PRJ1.RESET 48.26,77.98 46.74,79.5 46.74,90.74 51.31,95.31 74.74,95.31 77.98,92.08 77.98,88.84 82.55,84.26 S2.3
N$60
  Top 0.254: U$1.FB 92.65,24.83 92.65,34.73 88.65,38.73 81.98,38.73 72.26,48.45 69.6,48.45 63.5,54.55 50.93,54.55 PRJ1.A22/DAC1
RED-M1
  Bottom 1: DC-MOTOR.1 55.88,92.84 59.31,96.27 102.55,96.27 115.51,83.31 115.51,36.07 110.17,30.73 U$1.OUT1
RST
  Bottom 0.254: CONTROL.7 71.12,71.69 85.79,57.02 85.79,53.4 87.69,51.5 88.27,51.5 U$2.28
RX5
  Bottom 0.254: PRJ1.34/A15 50.93,36.83 50.93,37.4 53.21,39.69 53.21,42.35 60.83,49.98 60.83,55.88 63.88,58.93 63.88,64.83 65.98,66.93 65.98,74.17 CONTROL.5
SCK
  Top 0.254: 39.88,27.3 39.88,23.5 ENC2.3 | 39.88,27.3 39.88,42.16 35.69,46.35 35.69,46.93 PRJ1.27 | 57.6,23.69 56.64,24.64 56.64,24.83 54.17,27.3 39.88,27.3 | 57.6,23.69 60.83,26.92 74.55,26.92 75.5,25.97 75.5,23.5 ENC0.3 | 57.6,23.69 ENC1.3
SCL1
  Bottom 0.254: U$2.13 110.55,76.84 108.65,74.93 108.65,51.5 97.6,40.45 96.84,40.45 87.31,30.92 52.07,30.92 49.4,33.59 49.4,45.02 50.74,46.35 50.74,46.93 PRJ1.38/A19
SDA1  (via drill 0.64)
  Top 0.254: v59.69,29.78 53.21,36.26 53.21,41.59 50.93,43.88 50.93,44.45 PRJ1.37/A18 | v96.84,29.78 111.89,44.83 112.65,44.83 114.36,46.55 114.36,76.64 111.7,79.31 111.12,79.31 U$2.14
  Bottom 0.254: v96.84,29.78 v59.69,29.78
TX5  (via drill 0.64)
  Top 0.254: U$2.4 110.94,53.78 v107.51,53.78 107.51,50.36 97.6,40.45 96.46,40.45 94.36,42.55 89.03,42.55 v85.6,45.97 | v67.31,72.07 65.41,72.07 64.64,72.83 64.64,73.03 63.5,74.17 CONTROL.4
  Bottom 0.254: v107.51,53.78 86.55,32.83 60.64,32.83 59.31,34.16 50.93,34.16 PRJ1.33/A14 | v67.31,72.07 69.6,72.07 79.31,62.36 79.31,57.98 85.6,51.69 v85.6,45.97
WH_ENC_B  (via drill 0.64)
  Top 0.254: v55.69,32.07 52.45,35.31 52.45,37.21 50.93,38.73 50.93,39.31 PRJ1.35/A16 | v97.03,67.5 v97.03,41.59
  Bottom 0.254: v55.69,32.07 87.31,32.07 96.84,41.59 v97.03,41.59 | v97.03,67.5 97.03,77.41 81.98,92.46 69.03,92.46 68.64,92.08 DC-MOTOR.6
Y_ENC_A
  Bottom 0.254: PRJ1.36/A17 50.93,41.97 50.93,42.55 53.21,44.83 53.21,74.36 58.93,80.07 65.02,80.07 67.5,82.55 67.5,90.36 66.17,91.69 66.17,92.08 DC-MOTOR.5

### Text on the board
tNames: M1 | M2 | GND | VDD | B | A | MOTOR / 12-24V | MOTOR / GND | INT | SCL | SDA | GND | 3.3V | D0 | GND | 3.3V | 5.0V | TX5 | RX5 | A0 | RST | A | GND | MISO | MOSI | SCK | CS2 | +3.3V | GND | MISO | MOSI | SCK | CS1 | +3.3V | GND | MISO | MOSI | SCK | CS0 | +3.3V